# EAGLE schematic Rvg Robot (EAGLE 6.4)
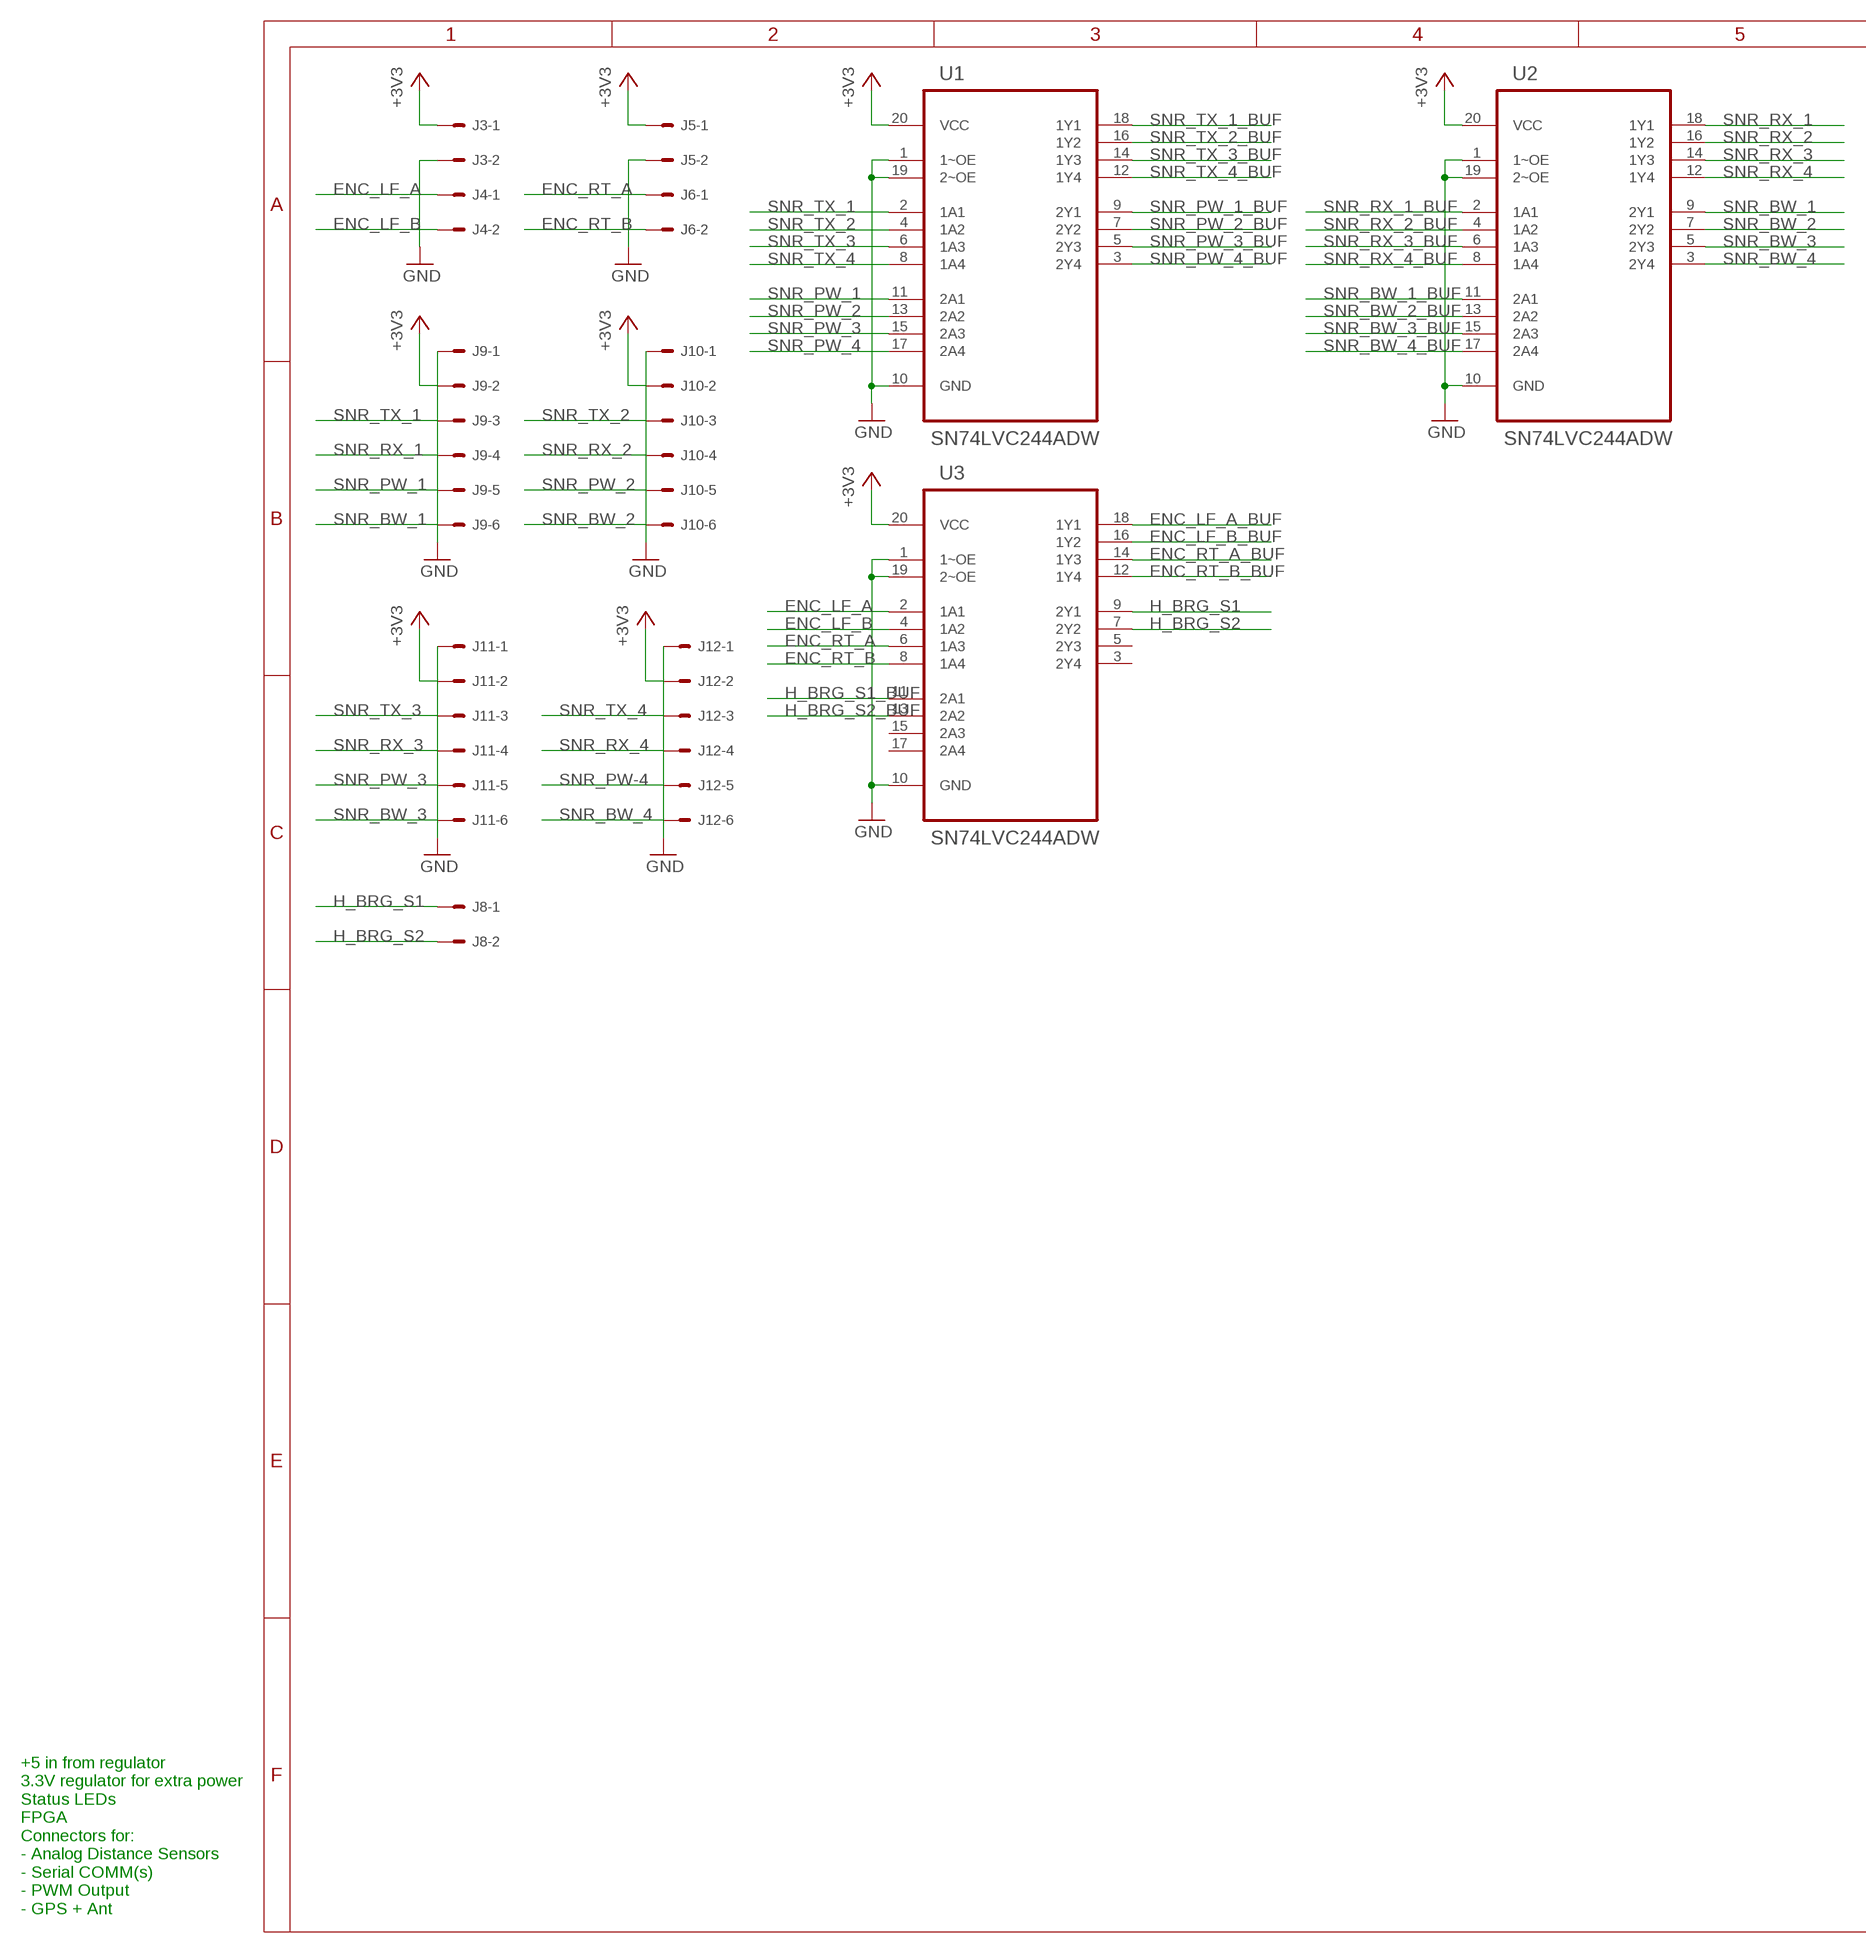
[diagram p0: schematic, sheet 1, part 1 of 2]
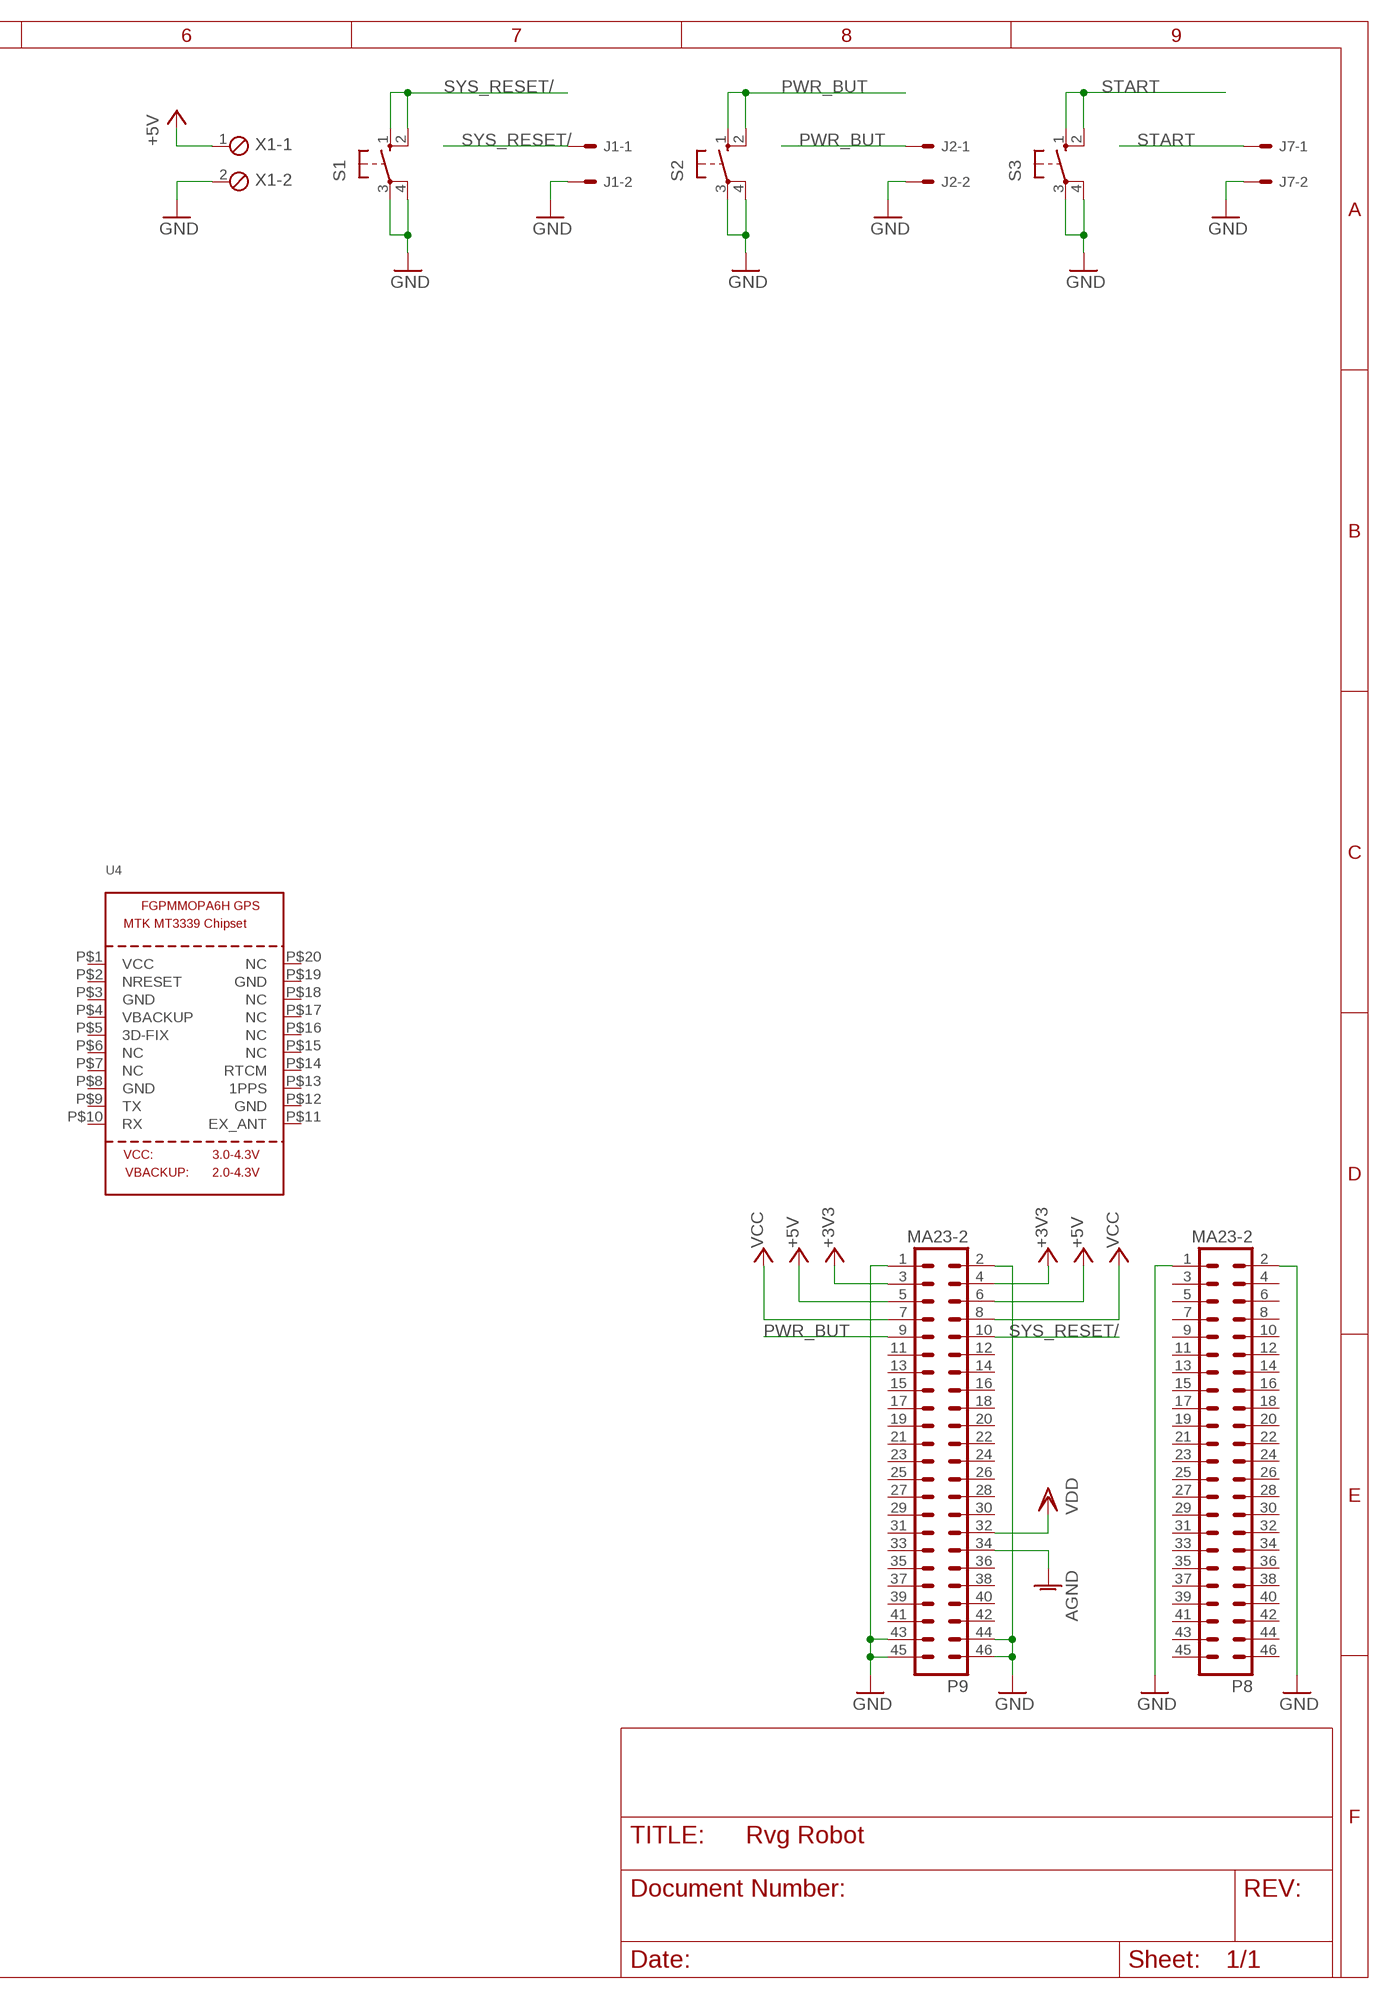
[diagram p1: schematic, sheet 1, part 2 of 2]

## Parts
J1  22-27-2021-02  [6410-02]
J2  22-27-2021-02  [6410-02]
J3  22-27-2021-02  [6410-02]
J4  22-27-2021-02  [6410-02]
J5  22-27-2021-02  [6410-02]
J6  22-27-2021-02  [6410-02]
J7  22-27-2021-02  [6410-02]
J8  22-27-2021-02  [6410-02]
J9  22-27-2061-06  [6410-06]
J10  22-27-2061-06  [6410-06]
J11  22-27-2061-06  [6410-06]
J12  22-27-2061-06  [6410-06]
P8  MA23-2  [MA23-2]
P9  MA23-2  [MA23-2]
S1  10-XX  [B3F-10XX]
S2  10-XX  [B3F-10XX]
S3  10-XX  [B3F-10XX]
U1  SN74LVC244ADW  [SOIC127P1030X265-20N]
U2  SN74LVC244ADW  [SOIC127P1030X265-20N]
U3  SN74LVC244ADW  [SOIC127P1030X265-20N]
U4  GPS_FGPMMOPA6H  [FGPMMOPA6H]
X1  MPT2  [2POL254]

## Nets
+3V3: J3.1 J5.1 J9.2 J10.2 J11.2 J12.2 P9.3 P9.4 U1.20(VCC) U2.20(VCC) U3.20(VCC)
+5V: P9.5 P9.6 X1.1
AGND: P9.34
ENC_LF_A: J4.1 U3.2(1A1)
ENC_LF_A_BUF: U3.18(1Y1)
ENC_LF_B: J4.2 U3.4(1A2)
ENC_LF_B_BUF: U3.16(1Y2)
ENC_RT_A: J6.1 U3.6(1A3)
ENC_RT_A_BUF: U3.14(1Y3)
ENC_RT_B: J6.2 U3.8(1A4)
ENC_RT_B_BUF: U3.12(1Y4)
GND: J1.2 J2.2 J3.2 J5.2 J7.2 J9.1 J10.1 J11.1 J12.1 P8.2 P9.1 P9.2 P9.43 P9.44 P9.45 P9.46 S1.3(P) S1.4(P1) S2.3(P) S2.4(P1) S3.3(P) S3.4(P1) U1.1(1~OE) U1.10(GND) U1.19(2~OE) U2.1(1~OE) U2.10(GND) U2.19(2~OE) U3.1(1~OE) U3.10(GND) U3.19(2~OE) X1.2
H_BRG_S1: J8.1 U3.9(2Y1)
H_BRG_S1_BUF: U3.11(2A1)
H_BRG_S2: J8.2 U3.7(2Y2)
H_BRG_S2_BUF: U3.13(2A2)
PWR_BUT: J2.1 P9.9 S2.1(S) S2.2(S1)
SNR_BW_1: J9.6 U2.9(2Y1)
SNR_BW_1_BUF: U2.11(2A1)
SNR_BW_2: J10.6 U2.7(2Y2)
SNR_BW_2_BUF: U2.13(2A2)
SNR_BW_3: J11.6 U2.5(2Y3)
SNR_BW_3_BUF: U2.15(2A3)
SNR_BW_4: J12.6 U2.3(2Y4)
SNR_BW_4_BUF: U2.17(2A4)
SNR_PW-4: J12.5
SNR_PW_1: J9.5 U1.11(2A1)
SNR_PW_1_BUF: U1.9(2Y1)
SNR_PW_2: J10.5 U1.13(2A2)
SNR_PW_2_BUF: U1.7(2Y2)
SNR_PW_3: J11.5 U1.15(2A3)
SNR_PW_3_BUF: U1.5(2Y3)
SNR_PW_4: U1.17(2A4)
SNR_PW_4_BUF: U1.3(2Y4)
SNR_RX_1: J9.4 U2.18(1Y1)
SNR_RX_1_BUF: U2.2(1A1)
SNR_RX_2: J10.4 U2.16(1Y2)
SNR_RX_2_BUF: U2.4(1A2)
SNR_RX_3: J11.4 U2.14(1Y3)
SNR_RX_3_BUF: U2.6(1A3)
SNR_RX_4: J12.4 U2.12(1Y4)
SNR_RX_4_BUF: U2.8(1A4)
SNR_TX_1: J9.3 U1.2(1A1)
SNR_TX_1_BUF: U1.18(1Y1)
SNR_TX_2: J10.3 U1.4(1A2)
SNR_TX_2_BUF: U1.16(1Y2)
SNR_TX_3: J11.3 U1.6(1A3)
SNR_TX_3_BUF: U1.14(1Y3)
SNR_TX_4: J12.3 U1.8(1A4)
SNR_TX_4_BUF: U1.12(1Y4)
START: J7.1 S3.1(S) S3.2(S1)
SYS_RESET/: J1.1 P9.10 S1.1(S) S1.2(S1)
VCC: P9.7 P9.8
VDD: P9.32
Unconnected: P8.1 P8.3 P8.4 P8.5 P8.6 P8.7 P8.8 P8.9 P8.10 P8.11 P8.12 P8.13 P8.14 P8.15 P8.16 P8.17 P8.18 P8.19 P8.20 P8.21 P8.22 P8.23 P8.24 P8.25 P8.26 P8.27 P8.28 P8.29 P8.30 P8.31 P8.32 P8.33 P8.34 P8.35 P8.36 P8.37 P8.38 P8.39 P8.40 P8.41 P8.42 P8.43 P8.44 P8.45 P8.46 P9.11 P9.12 P9.13 P9.14 P9.15 P9.16 P9.17 P9.18 P9.19 P9.20 P9.21 P9.22 P9.23 P9.24 P9.25 P9.26 P9.27 P9.28 P9.29 P9.30 P9.31 P9.33 P9.35 P9.36 P9.37 P9.38 P9.39 P9.40 P9.41 P9.42 U3.3(2Y4) U3.5(2Y3) U3.15(2A3) U3.17(2A4) U4.P$1(VCC) U4.P$2(NRESET) U4.P$3(GND) U4.P$4(VBACKUP) U4.P$5(3D-FIX) U4.P$6(NC) U4.P$7(NC) U4.P$8(GND) U4.P$9(TX) U4.P$10(RX) U4.P$11(EX_ANT) U4.P$12(GND) U4.P$13(1PPS) U4.P$14(RTCM) U4.P$15(NC) U4.P$16(NC) U4.P$17(NC) U4.P$18(NC) U4.P$19(GND) U4.P$20(NC)

## Notes on the sheet
- +5 in from regulator
  3.3V regulator for extra power
  Status LEDs
  FPGA
  Connectors for:
  - Analog Distance Sensors
  - Serial COMM(s)
  - PWM Output
  - GPS + Ant

## Library data of the parts
J1-J8 = con-molex:22-?-02: CONNECTOR wire to board 2.54 mm (.1 inch) pitch header; OC_FARNELL: unknown; OC_NEWARK: unknown
J9-J12 = con-molex:22-?-06: CONNECTOR wire to board 2.54 mm (.1 inch) pitch header; OC_FARNELL: unknown; OC_NEWARK: unknown
P8 P9 = con-lstb:MA23-2
S1-S3 = switch-omron:10-XX: OMRON SWITCH; MPN: B3F-1000; OC_FARNELL: 176432; OC_NEWARK: 36M3542
U1-U3 = Texas Instruments_By_element14_Batch_1:SN74LVC244ADW: OCTAL BUFFER/DRIVER WITH 3-STATE OUTPUTS; MPN: SN74LVC244ADW; OC_FARNELL: 1102982; OC_NEWARK: 76C4240; PACKAGE: SOIC-20; SUPPLIER: Texas Instruments
U4 = adafruit:GPS_FGPMMOPA6H: GPS Module - MTK MT3339 Chipset, -165dBm sensitivity, 22 channels, 10Hz, auto-select external antenna options
X1 = con-phoenix-254:MPT2: PHOENIX CONNECTOR; OC_FARNELL: unknown; OC_NEWARK: unknown